# Altium schematic sheet [7] ETH.SchDoc: Ethernet
size 393 x 281 mm; SheetNumber: 7; SheetTotal: 21; PageSetup: Record=PageOptions|CenterHorizontal=True|CenterVertical=True|PrintScale=0.94|XCorrection=0.00|YCorrection=0.00|PrintKind=0|BorderSize=5000000|LeftOffset=0|BottomOffset=0|Orientation=2|PaperLength=1000|PaperWidth=1000|Scale=100|PaperSource=15|PrintQuality=600|MediaType=1|DitherType=10|PrintScaleMode=1|PaperKind=A4; Adr1: August Barks gata 6B; Adr2: SE-421 32 Västra Frölunda; Adr3: Sweden; Webpage: www.omnisys.se
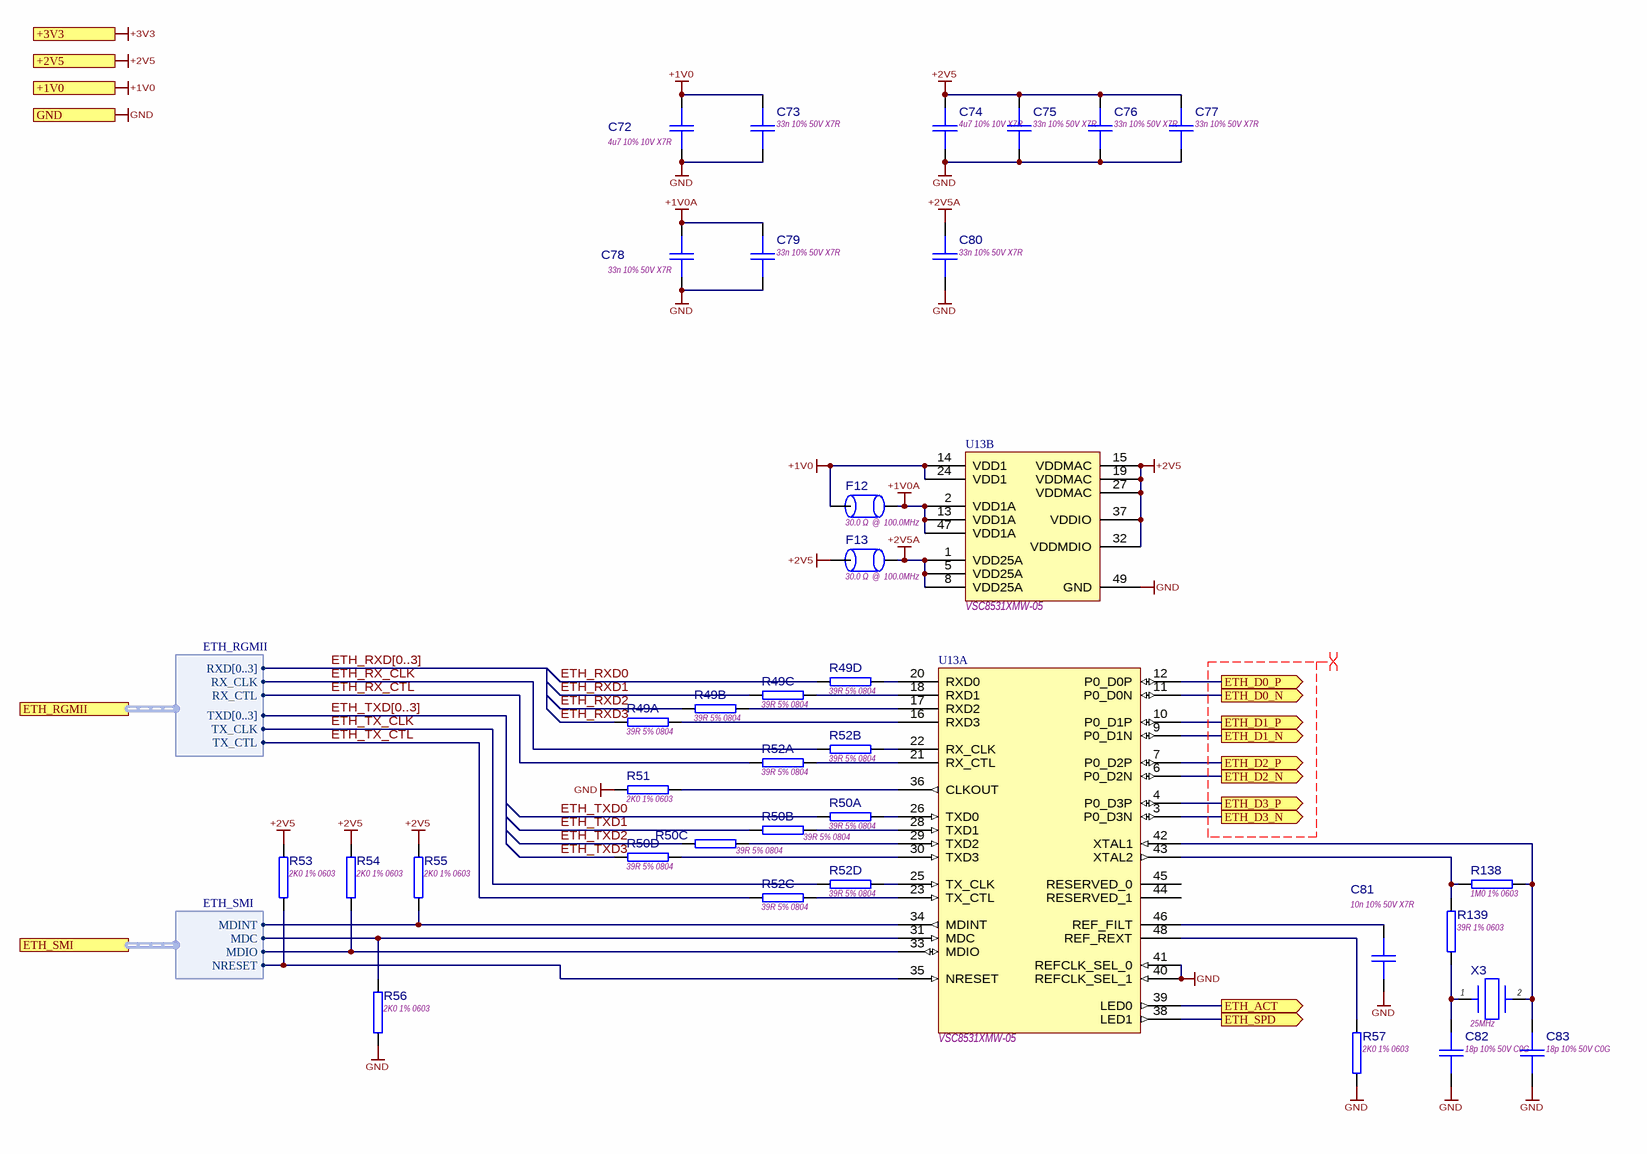
[diagram p0: [7] ETH.SchDoc]

## Parts
C72  4u7 10% 10V X7R  [CAPC2012X145N]
C73  33n 10% 50V X7R  [CAPC1005X55N]
C74  4u7 10% 10V X7R  [CAPC2012X145N]
C75  33n 10% 50V X7R  [CAPC1005X55N]
C76  33n 10% 50V X7R  [CAPC1005X55N]
C77  33n 10% 50V X7R  [CAPC1005X55N]
C78  33n 10% 50V X7R  [CAPC1005X55N]
C79  33n 10% 50V X7R  [CAPC1005X55N]
C80  33n 10% 50V X7R  [CAPC1005X55N]
C81  10n 10% 50V X7R  [CAPC1608X90N]
C82  18p 10% 50V C0G  [CAPC1608X90N]
C83  18p 10% 50V C0G  [CAPC1608X90N]
F12  30.0 Ω  @  100.0MHz  [INDC2012X11L]
F13  30.0 Ω  @  100.0MHz  [INDC2012X11L]
R49  39R 5% 0804  [RESCAXS50P100X200X45-8N]  (parts A,B,C,D of 4)
R50  39R 5% 0804  [RESCAXS50P100X200X45-8N]  (parts A,B,C,D of 4)
R51  2K0 1% 0603  [RESC1608N]
R52  39R 5% 0804  [RESCAXS50P100X200X45-8N]  (parts A,B,C,D of 4)
R53  2K0 1% 0603  [RESC1608N]
R54  2K0 1% 0603  [RESC1608N]
R55  2K0 1% 0603  [RESC1608N]
R56  2K0 1% 0603  [RESC1608N]
R57  2K0 1% 0603  [RESC1608N]
R138  1M0 1% 0603  [RESC1608L]
R139  39R 1% 0603  [RESC1608L]
U13  VSC8531XMW-05  [QFN40P600X600X90_HS-49N]  (parts A,B of 2)
X3  25MHz  [XTAL_5x3.2MM]

## Ports
+1V0, +2V5, +3V3, ETH_ACT (out), ETH_D0_N (out), ETH_D0_P (out), ETH_D1_N (out), ETH_D1_P (out), ETH_D2_N (out), ETH_D2_P (out), ETH_D3_N (out), ETH_D3_P (out), ETH_RGMII (harness ETH_RGMII), ETH_SMI (harness ETH_SMI), ETH_SPD (out), GND

## Harnesses
ETH_RGMII: RXD[0..3], RX_CLK, RX_CTL, TXD[0..3], TX_CLK, TX_CTL
ETH_SMI: MDIO, MDC, MDINT, NRESET

## Nets
+1V0: C72.2 C73.1 F12.1 U13.14(VDD1) U13.24(VDD1) ; port +1V0
+1V0A: C78.1 C79.1 F12.2 U13.2(VDD1A) U13.13(VDD1A) U13.47(VDD1A)
+2V5: C74.2 C75.1 C76.1 C77.1 F13.1 R53.2 R54.2 R55.2 U13.15(VDDMAC) U13.19(VDDMAC) U13.27(VDDMAC) U13.32(VDDMDIO) U13.37(VDDIO) ; port +2V5
+2V5A: C80.1 F13.2 U13.1(VDD25A) U13.5(VDD25A) U13.8(VDD25A)
+3V3: port +3V3
GND: C72.1 C73.2 C74.1 C75.2 C76.2 C77.2 C78.2 C79.2 C80.2 C81.2 C82.1 C83.1 R51.2 R56.1 R57.1 U13.40(REFCLK_SEL_1) U13.41(REFCLK_SEL_0) U13.49(GND) ; port GND
ETH_ACT: U13.39(LED0) ; port ETH_ACT
ETH_D0_N: U13.11(P0_D0N) ; port ETH_D0_N
ETH_D0_P: U13.12(P0_D0P) ; port ETH_D0_P
ETH_D1_N: U13.9(P0_D1N) ; port ETH_D1_N
ETH_D1_P: U13.10(P0_D1P) ; port ETH_D1_P
ETH_D2_N: U13.6(P0_D2N) ; port ETH_D2_N
ETH_D2_P: U13.7(P0_D2P) ; port ETH_D2_P
ETH_D3_N: U13.3(P0_D3N) ; port ETH_D3_N
ETH_D3_P: U13.4(P0_D3P) ; port ETH_D3_P
ETH_RX_CLK: R52.2 ; port ETH_RGMII.RX_CLK
ETH_RX_CTL: R52.1 ; port ETH_RGMII.RX_CTL
ETH_RXD0: R49.4
ETH_RXD1: R49.3
ETH_RXD2: R49.2
ETH_RXD3: R49.1
ETH_SPD: U13.38(LED1) ; port ETH_SPD
ETH_TX_CLK: R52.4 ; port ETH_RGMII.TX_CLK
ETH_TX_CTL: R52.3 ; port ETH_RGMII.TX_CTL
ETH_TXD0: R50.1
ETH_TXD1: R50.2
ETH_TXD2: R50.3
ETH_TXD3: R50.4
NetC81_1: C81.1 U13.46(REF_FILT)
NetC82_2: C82.2 R139.2 X3.1
NetC83_2: C83.2 R138.2 U13.42(XTAL1) X3.2
NetR49_5: R49.5 U13.20(RXD0)
NetR49_6: R49.6 U13.18(RXD1)
NetR49_7: R49.7 U13.17(RXD2)
NetR49_8: R49.8 U13.16(RXD3)
NetR50_5: R50.5 U13.30(TXD3)
NetR50_6: R50.6 U13.29(TXD2)
NetR50_7: R50.7 U13.28(TXD1)
NetR50_8: R50.8 U13.26(TXD0)
NetR51_1: R51.1 U13.36(CLKOUT)
NetR52_5: R52.5 U13.25(TX_CLK)
NetR52_6: R52.6 U13.23(TX_CTL)
NetR52_7: R52.7 U13.22(RX_CLK)
NetR52_8: R52.8 U13.21(RX_CTL)
NetR53_1: R53.1 U13.35(NRESET) ; port ETH_SMI.NRESET
NetR54_1: R54.1 U13.33(MDIO) ; port ETH_SMI.MDIO
NetR55_1: R55.1 U13.34(MDINT) ; port ETH_SMI.MDINT
NetR56_2: R56.2 U13.31(MDC) ; port ETH_SMI.MDC
NetR57_2: R57.2 U13.48(REF_REXT)
NetR138_1: R138.1 R139.1 U13.43(XTAL2)

Not connected (* = marked no-connect by the designer): U13 44(RESERVED_1) 45(RESERVED_0)

## Buses and harness runs
bus ETH_RXD[0..3]
bus ETH_TXD[0..3]

## Layout directives
differential pair; net class Diffpairs_ETH; rule Differential Pairs Routing [Pref Gap = 0.1mm    Min Gap  = 0.1mm    Max Gap  = 0.1mmPref Width = 0.1mm    Min Width  = 0.1mm    Max Width  = 0.1mm]: (no net found under the mark)

## Notes on the sheet
- Title:
- SVN:
- August Barks gata 6B
- SE-421 32 Västra Frölunda
- Omnisys Instruments AB
- PCB ASY:
- PCB:
- SVN Folder:
- www.omnisys.se
- Page:
- of
- Print date:
- Page size:
- A3
- Information contained in this drawing is confidential. Copying, distributing or use in any matter, other than that specified by OMNISYS INSTRUMENTS AB, is strictly prohibited.

## Library data of the parts
C72 C74 = CMP-0300-003983-5: Ceramic Chip Capacitor, 0805/2012; Capacitance: 4.7µF; Package: 2012/0805; Temperature Charateristics: X7R; Tolerance: 10%; Thickness: 1.4mm; Rated Voltage: 10V
C73 C75-C80 = CMP-0300-002958-5: Ceramic Chip Capacitor, 0402/1005; Capacitance: 33nF; Package: 0402/1005; Temperature Charateristics: X7R; Tolerance: 10%; Thickness: 550µm; Rated Voltage: 50V
C81 = CMP-0300-002475-6: Ceramic Chip Capacitor, 0603/1608; Temperature Charateristics: C0G; Tolerance: 5%; Capacitance: 10nF; Package: 1608/0603; Rated Voltage: 50V; Thickness: 900µm; Weight: 9mg
C82 C83 = CMP-0300-002440-6: Ceramic Chip Capacitor, 0603/1608; Tolerance: 5%; Capacitance: 18pF; Package: 1608/0603; Temperature Charateristics: C0G; Rated Voltage: 50V; Thickness: 900µm; Weight: 9mg
F12 F13 = CMP-0600-000010-2: Ferrite bead, Würth Elektronik WE-CBF 2012 (0805), 74279206 ,  30.0 Ω  @  100.0MHz; Zmax@Freq: 55.0 Ω  @      1.0 GHz; Type: High Current; RDC: 25.0 mΩ; IDC: 3.0 A; Z@Freq: 30.0 Ω  @  100.0MHz; PartNumber: 74279206
R49 R50 R52 = CMP-1800-003024-3: Thick film resistor array, 4 Resistors, Convex terminals, 0804/2010; Value: 39; Maximum working voltage: 50V; Temp. Coefficent: 0.02%; Power: 62.5mW; Tolerance: 5%; Case/Package: 0804/2010; Composition: Thick film
R51 R53-R57 = CMP-1800-002028-5: Thick film Chip Resistor, 0603/1608; Value: 2k; Power: 100mW; Maximum working voltage: 75V; Temp. Coefficent: 0.01%; Tolerance: 1%; Case/Package: 0603/1608; Composition: Thick film
R138 = CMP-1800-002093-5: Thick film Chip Resistor, 0603/1608; Value: 1M; Power: 100mW; Maximum working voltage: 75V; Temp. Coefficent: 0.01%; Tolerance: 1%; Case/Package: 0603/1608; Composition: Thick film
R139 = CMP-1800-001988-5: Thick film Chip Resistor, 0603/1608; Value: 39; Power: 100mW; Maximum working voltage: 75V; Temp. Coefficent: 0.01%; Tolerance: 1%; Case/Package: 0603/1608; Composition: Thick film
U13 = CMP-2100-000583-2: Single Port Gigabit Ethernet Copper PHY; Number of Circuits: 1; PartNumber: VSC8531XMW-05; Mount: Surface Mount; Case/Package: QFN; Min Operating Temperature: -40°C; Max Operating Temperature: 125°C
X3 = CMP-2400-000020-1: 25MHz 5 x 3.2 mm SMD GLASS CRYSTAL; PartNumber: 7A-25.000MAHE-T